# Altium project Mixer_project.PrjPcb
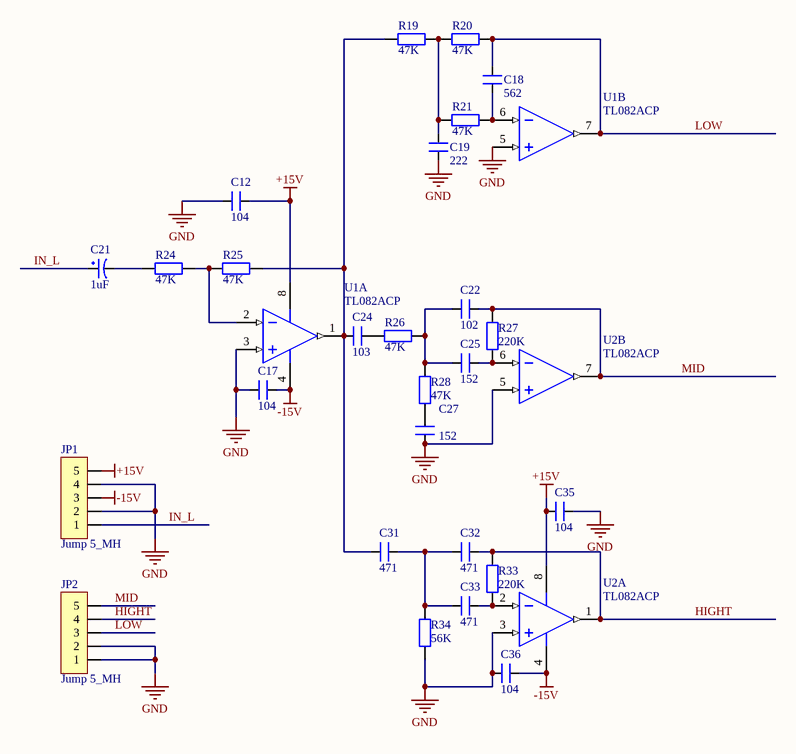
[diagram p0: Righ_CH.SchDoc]
1 sheet, 28 parts. Net scope: global (net labels, ports and power ports of the same name join across sheets).
Board file: PCB2.PcbDoc

## Sheet Righ_CH.SchDoc
size A

### Parts
C12  104  [TU_GOM(104-->105pF)]
C17  104  [TU_GOM(104-->105pF)]
C18  562  [WIMA-FKP-2-1nF]
C19  222  [WIMA-FKP-2-1nF]
C21  1uF  [CP1/3.0]
C22  102  [WIMA-FKP-2-1nF]
C24  103  [WIMA-FKP-2-1nF]
C25  152  [WIMA-FKP-2-1nF]
C27  152  [WIMA-FKP-2-1nF]
C31  471  [WIMA-FKP-2-1nF]
C32  471  [WIMA-FKP-2-1nF]
C33  471  [WIMA-FKP-2-1nF]
C35  104  [TU_GOM(104-->105pF)]
C36  104  [TU_GOM(104-->105pF)]
JP1  Jump 5_MH  [Jump 5]
JP2  Jump 5_MH  [Jump 5]
R19  47K  [TRO_VACH_ 1/4W]
R20  47K  [TRO_VACH_ 1/4W]
R21  47K  [TRO_VACH_ 1/4W]
R24  47K  [TRO_VACH_ 1/4W]
R25  47K  [TRO_VACH_ 1/4W]
R26  47K  [TRO_VACH_ 1/4W]
R27  220K  [TRO_VACH_ 1/4W]
R28  47K  [TRO_VACH_ 1/4W]
R33  220K  [TRO_VACH_ 1/4W]
R34  56K  [TRO_VACH_ 1/4W]
U1  TL082ACP  [DIP8]  (parts A,B of 2)
U2  TL082ACP  [DIP8]  (parts A,B of 2)

### Nets
+15V: C12.2 C35.2 JP1.5 U1.8(V+) U2.8(V+)
-15V: C17.2 C36.1 JP1.3 U1.4(V-) U2.4(V-)
GND: C12.1 C17.1 C19.1 C27.2 C35.1 C36.2 JP1.2 JP1.4 JP2.1 JP2.2 R34.1 U1.3(IN+) U1.5(IN+) U2.3(IN+) U2.5(IN+)
HIGHT: C32.1 JP2.4 R33.2 U2.1(OUT)
IN_L: C21.1 JP1.1
LOW: C18.2 JP2.3 R20.2 U1.7(OUT)
MID: C22.1 JP2.5 R27.2 U2.7(OUT)
NetC18_1: C18.1 R21.2 U1.6(IN-)
NetC19_2: C19.2 R19.2 R20.1 R21.1
NetC21_2: C21.2 R24.1
NetC22_2: C22.2 C25.2 R26.1 R28.2
NetC24_1: C24.1 C31.2 R19.1 R25.2 U1.1(OUT)
NetC24_2: C24.2 R26.2
NetC25_1: C25.1 R27.1 U2.6(IN-)
NetC27_1: C27.1 R28.1
NetC31_1: C31.1 C32.2 C33.2 R34.2
NetC33_1: C33.1 R33.1 U2.2(IN-)
NetR24_2: R24.2 R25.1 U1.2(IN-)

### Library data of the parts
C12 C17-C19 C22 C24 C25 C27 C31-C33 C35 C36 = TU_MICA_ 104 100V(2A104J)_MH: Value: 0.1uF
C21 = TU_HOA_4.7uF_100V_MH: Value: 4700uF/50V
JP1 JP2 = Jump 5_MH: Jump 5P 2.54
R19-R21 R24-R28 R33 R34 = TRO_VACH_1/2W_MH: Resistor; Value: 1K; Published: 8-Jun-2000; LatestRevisionDate: 17-Jul-2002; LatestRevisionNote: Re-released for DXP Platform.; Publisher: Altium Limited
U1 U2 = TL082ACP: JFET-Input Operational Amplifier; Published: 17-Jul-2002; LatestRevisionDate: 06-Jun-2005; LatestRevisionNote: Stylized 3D Model Added.; DatasheetVersion: 1988; PackageReference: 626-05; Publisher: Altium Limited; PackageDescription: DIP; 8 Leads; Row Spacing 7.62 mm; Pitch 2.54 mm; ComponentLink1Description: Manufacturer Link; ComponentLink1URL: http://www.onsemi.com/site/products/parametrics/0,4446,251,00.html